# EAGLE design USBCFootprintTest (EAGLE 9.6.2)
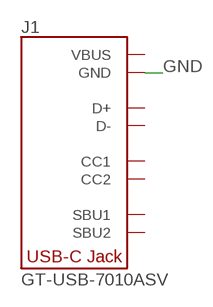
[diagram p0: schematic, sheet 1]

## Parts
J1  USB-C-JACK  [GSWITCH-GT-USB-7010ASV]

## Nets
GND: J1.A1B12(GND) J1.B1A12(GND) J1.GND1(GND) J1.GND2(GND) J1.GND3(GND) J1.GND4(GND) J1.GND5(GND) J1.GND6(GND) J1.GND7(GND) J1.GND8(GND)
Unconnected: J1.A4B9(VBUS) J1.A5(CC1) J1.A6(D+) J1.A7(D-) J1.A8(SBU1) J1.B4A9(VBUS) J1.B5(CC2) J1.B6(D+) J1.B7(D-) J1.B8(SBU2)

## Library data of the parts
J1 = EagleLibrary:USB-C-JACK; MFG: G-Switch; PN: GT-USB-7010ASV

## Board
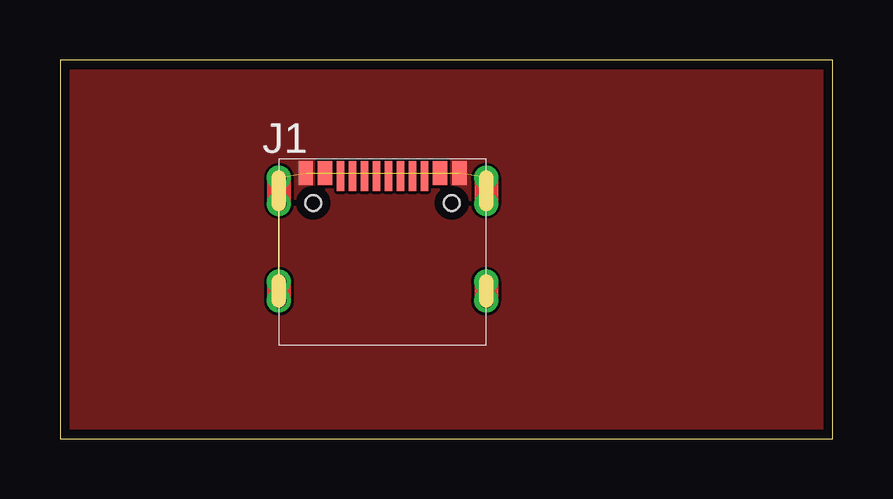
[diagram p1: board, top side]
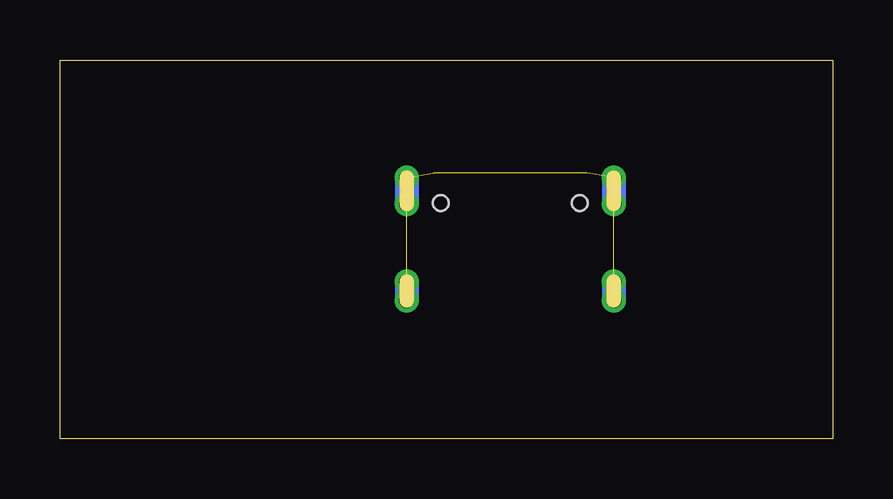
[diagram p2: board, bottom side, seen from below]

Size 32.2 x 15.8 mm. Coordinates in mm from the lower left corner, seen from the top.
Outline: 0,0 32.2,0 32.2,15.8 0,15.8 0,0
Copper layers (1*2*15*16): Top 0.035559375mm / dielectric 0.17018125mm / layer 2 0.01778125mm / dielectric 47mil / layer 15 0.01778125mm / dielectric 0.17018125mm / Bottom 0.035559375mm
Design rules "OshPark4Layer-TentVias": minimum track width 5mil, minimum drill 10mil, track to track 5mil, track to pad 5mil, pad to pad 5mil, via to via 5mil, smd to smd 5mil, copper to edge 15mil, drill to drill 6mil, minimum pad ring 4mil, minimum via ring 4mil, stop-mask expansion 2.5mil, vias tented up to drill 25mil, thermal gap 10mil

### Footprints (pad centres in the part's own frame; a part is rotated, then mirrored left to right if it is on the bottom)
GSWITCH-GT-USB-7010ASV = smd 0.6 x 1: A1B12 -3.2,4.92; A4B9 -2.4,4.92; B1A12 3.2,4.92; B4A9 2.4,4.92 | smd 0.3 x 1.24: A5 -1.25,4.8; A6 -0.25,4.8; A7 0.25,4.8; A8 1.25,4.8; B5 1.75,4.8; B6 0.75,4.8; B7 -0.75,4.8; B8 -1.75,4.8 | drill 0.6 pad 1: GND1 -4.32,4.73; GND2 -4.32,3.63; GND3 4.32,4.73; GND4 4.32,3.63; GND5 4.32,0.4; GND6 4.32,-0.4; GND7 -4.32,0.4; GND8 -4.32,-0.4 | hole 0.65: -2.89,3.68; 2.89,3.68

### Placement (x,y rotation side)
J1  13.44,6.16 0 top

### Tracks (layer width: path | path; a pad name or v marks a point on that pad's centre or on a via)
GND  (9 unrouted)
  pour Top (no thermals): -0.7,16.7 33.1,16.7 33.1,-1 -0.7,-1
  pour Bottom (no thermals): -1.9,17.4 35.3,17.4 35.3,-2 -1.9,-2